# EAGLE design SterownikDriver_01 (EAGLE 7.5.0)
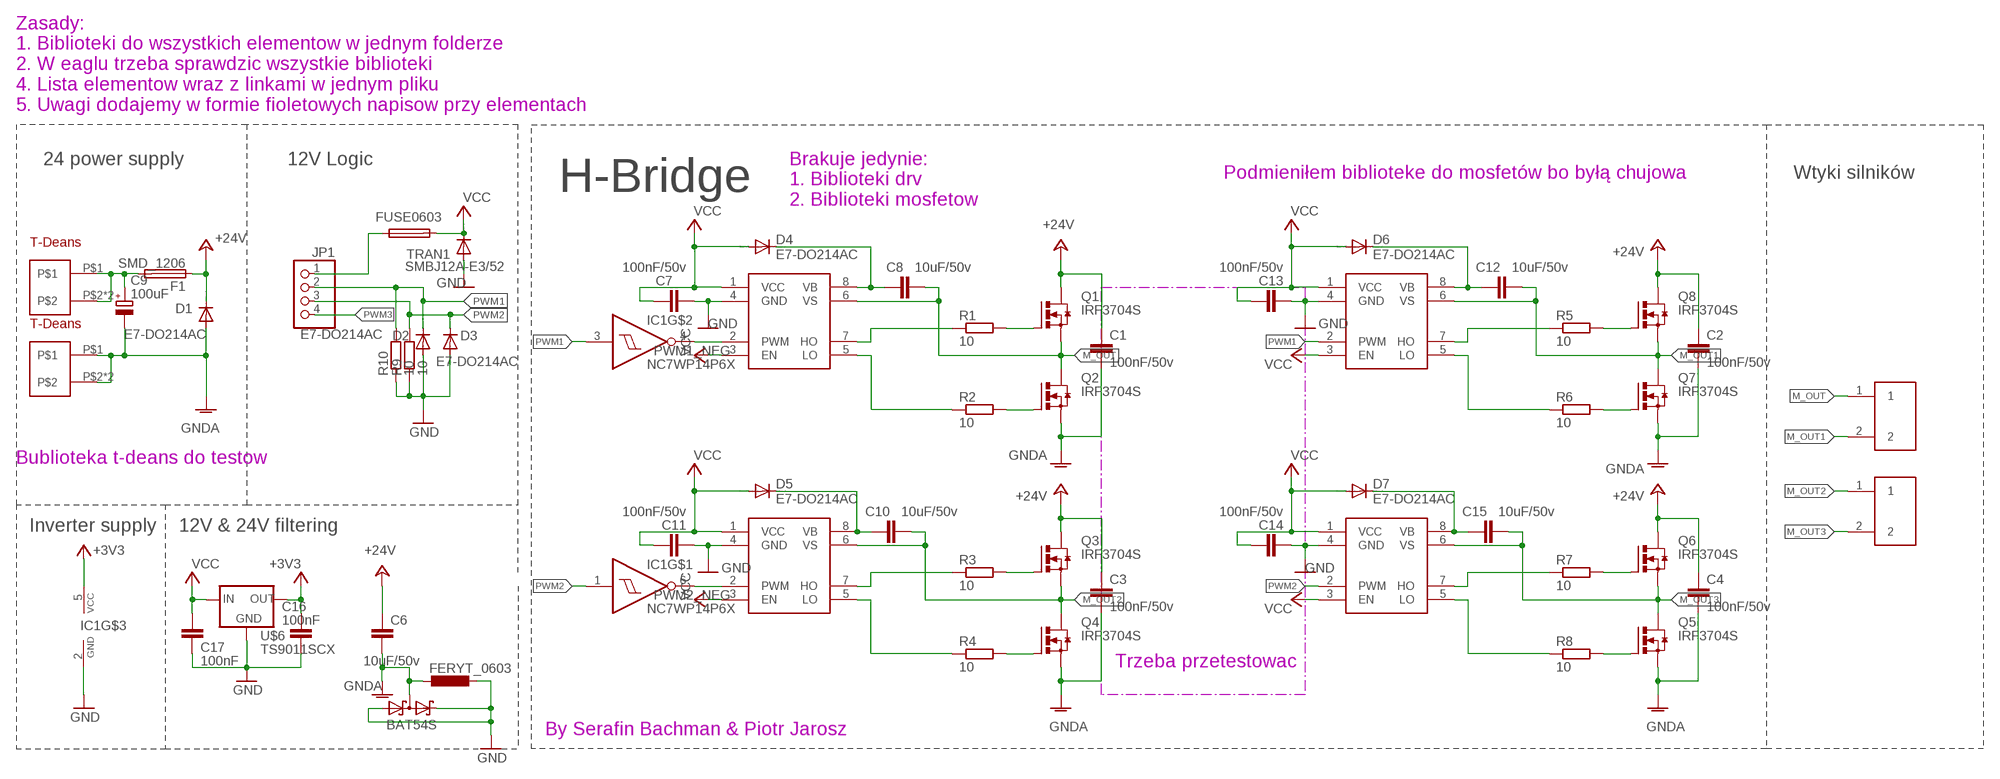
[diagram p0: schematic, sheet 1]

## Parts
C1  100nF/50v  C-EUC0603K  [C0603K]
C2  100nF/50v  C-EUC0603K  [C0603K]
C3  100nF/50v  C-EUC0603K  [C0603K]
C4  100nF/50v  C-EUC0603K  [C0603K]
C6  10uF/50v  C-EUC0603K  [C0603K]
C7  100nF/50v  C-EUC0603K  [C0603K]
C8  10uF/50v  C-EUC0603K  [C0603K]
C9  100uF  CPOL-EU140CLH-0810  [140CLH-0810]
C10  10uF/50v  C-EUC0603K  [C0603K]
C11  100nF/50v  C-EUC0603K  [C0603K]
C12  10uF/50v  C-EUC0603K  [C0603K]
C13  100nF/50v  C-EUC0603K  [C0603K]
C14  100nF/50v  C-EUC0603K  [C0603K]
C15  10uF/50v  C-EUC0603K  [C0603K]
C16  100nF  C-EUC0603K  [C0603K]
C17  100nF  C-EUC0603K  [C0603K]
D1  E7-DO214AC  [DO214AC]
D2  E7-DO214AC  [DO214AC]
D3  E7-DO214AC  [DO214AC]
D4  E7-DO214AC  [DO214AC]
D5  E7-DO214AC  [DO214AC]
D6  E7-DO214AC  [DO214AC]
D7  E7-DO214AC  [DO214AC]
D8  BAT54S  [SOT23]
F1  SMD_1206  [1026]
GND  T-DEANS  [T-DEANS]
IC1  NC7WP14P6X  [SOT65P210X110-6AN_SC88_SC70-6]
JP1  PINHD-1X4  [1X04]
Q1  IRF3704S  [D2PACK]
Q2  IRF3704S  [D2PACK]
Q3  IRF3704S  [D2PACK]
Q4  IRF3704S  [D2PACK]
Q5  IRF3704S  [D2PACK]
Q6  IRF3704S  [D2PACK]
Q7  IRF3704S  [D2PACK]
Q8  IRF3704S  [D2PACK]
R1  10  R-EU_R0603  [R0603]
R2  10  R-EU_R0603  [R0603]
R3  10  R-EU_R0603  [R0603]
R4  10  R-EU_R0603  [R0603]
R5  10  R-EU_R0603  [R0603]
R6  10  R-EU_R0603  [R0603]
R7  10  R-EU_R0603  [R0603]
R8  10  R-EU_R0603  [R0603]
R9  10  R-EU_R0603  [R0603]
R10  10  R-EU_R0603  [R0603]
TRAN1  SMBJ12A-E3/52  [DO214AA]
U1  IR2104  [SO08]
U2  IR2104  [SO08]
U3  IR2104  [SO08]
U4  IR2104  [SO08]
U$3  FUSE0603  [0603]
U$4  FERYT_0603  [R0603]
U$6  TS9011SCX  [SOT23]
U$7  PTB-02_5.08MM  [PTB-5.08MM-02]
U$9  PTB-02_5.08MM  [PTB-5.08MM-02]
VCC  T-DEANS  [T-DEANS]

## Nets
+3V3: C16.1 IC1.5(VCC) U$6.2(OUT)
+24V: C1.1 C2.1 C3.1 C4.1 C6.1 D1.C F1.P$1 Q1.2(D) Q3.2(D) Q6.2(D) Q8.2(D)
F2: JP1.1 U$3.1
GND: C7.2 C11.2 C13.2 C14.2 C16.2 C17.2 D2.A D3.A D8.1(A1) D8.2(C2) IC1.2(GND) R9.1 R10.1 TRAN1.A U1.4(GND) U2.4(GND) U3.4(GND) U4.4(GND) U$4.2 U$6.1(GND)
GNDA: C1.2 C2.2 C3.2 C4.2 C6.2 C9.- D1.A D8.3(C1A2) GND.P$1 GND.P$2 GND.P$3 Q2.3(S) Q4.3(S) Q5.3(S) Q7.3(S) U$4.1
M_OUT: C8.2 Q1.3(S) Q2.2(D) U1.6(VS) U$7.1
M_OUT1: C12.2 Q7.2(D) Q8.3(S) U2.6(VS) U$7.2
M_OUT2: C10.2 Q3.3(S) Q4.2(D) U3.6(VS) U$9.1
M_OUT3: C15.2 Q5.2(D) Q6.3(S) U4.6(VS) U$9.2
N$1: Q1.1(G) R1.2
N$2: Q2.1(G) R2.2
N$3: R1.1 U1.7(HO)
N$4: R2.1 U1.5(LO)
N$7: R5.1 U2.7(HO)
N$8: R6.1 U2.5(LO)
N$10: Q7.1(G) R6.2
N$11: Q8.1(G) R5.2
N$12: C10.1 D5.C U3.8(VB)
N$13: C9.+ F1.P$2 VCC.P$1 VCC.P$2 VCC.P$3
N$14: R3.1 U3.7(HO)
N$15: R4.1 U3.5(LO)
N$16: Q4.1(G) R4.2
N$17: Q3.1(G) R3.2
N$18: C15.1 D7.C U4.8(VB)
N$20: R7.1 U4.7(HO)
N$21: R8.1 U4.5(LO)
N$22: Q5.1(G) R8.2
N$23: Q6.1(G) R7.2
N$49: C8.1 D4.C U1.8(VB)
N$51: C12.1 D6.C U2.8(VB)
PWM1: D2.C IC1.3(I) JP1.2 R10.2 U2.2(PWM)
PWM1_NEG: IC1.4(O) U1.2(PWM)
PWM2: D3.C IC1.1(I) JP1.3 R9.2 U4.2(PWM)
PWM2_NEG: IC1.6(O) U3.2(PWM)
PWM3: JP1.4
VCC: C7.1 C11.1 C13.1 C14.1 C17.1 D4.A D5.A D6.A D7.A TRAN1.C U1.1(VCC) U1.3(EN) U2.1(VCC) U2.3(EN) U3.1(VCC) U3.3(EN) U4.1(VCC) U4.3(EN) U$3.2 U$6.3(IN)

## Notes on the sheet
- Zasady:
  1. Biblioteki do wszystkich elementow w jednym folderze
  2. W eaglu trzeba sprawdzic wszystkie biblioteki 
  4. Lista elementow wraz z linkami w jednym pliku
  5. Uwagi dodajemy w formie fioletowych napisow przy elementach
- 24 power supply | 12V Logic
- Podmieniłem biblioteke do mosfetów bo byłą chujowa | Wtyki silników
- H-Bridge
- Brakuje jedynie:
  1. Biblioteki drv
  2. Biblioteki mosfetow
- Bublioteka t-deans do testow
- Inverter supply | 12V & 24V filtering
- Trzeba przetestowac
- By Serafin Bachman & Piotr Jarosz

## Library data of the parts
C1-C4 C6-C8 C10-C17 = rcl:C-EU: CAPACITOR, European symbol
C9 = rcl:CPOL-EU: POLARIZED CAPACITOR, European symbol
D1-D7 = diode:E7-DO214AC
D8 = diode:BAT54S: Schottky Diodes Pin connection corrected 2011-05-04 Source: Fairchild .. BAT54.pdf
F1 = fuse:SMD_1206
GND VCC = Conector_T-deans:T-DEANS
IC1 = bufory,invertery:NC7W*14
JP1 = pinhead:PINHD-1X4: PIN HEADER
Q1-Q8 = transistor-power:IRF3704: SMPS MOSFET HEXFET® Power MOSFET Source: http://www.irf.com/product-info/datasheets/data/irf3704.pdf
R1-R10 = rcl:R-EU_: RESISTOR, European symbol
TRAN1 = diode:SMBJ12A-E3/52
U1-U4 = robione:IR2104
U$3 = fuse:FUSE0603
U$4 = rcl:FERYT_0603
U$6 = v-reg:TS9011SCX
U$7 U$9 = robione:PTB-02

## Board
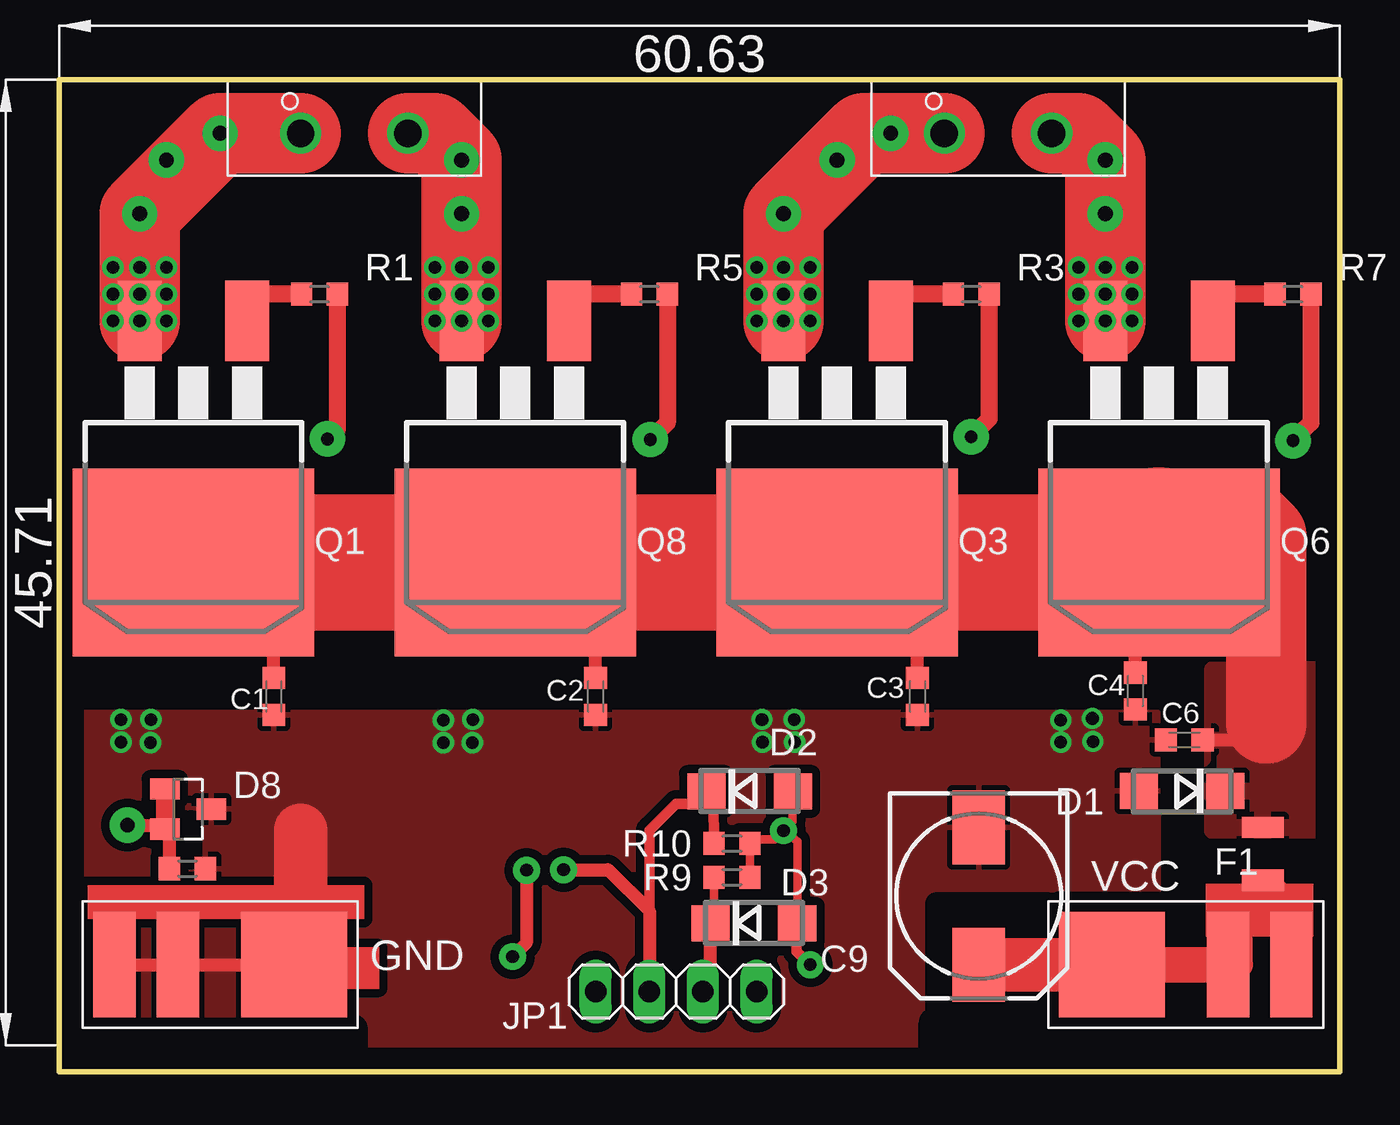
[diagram p1: board, top side]
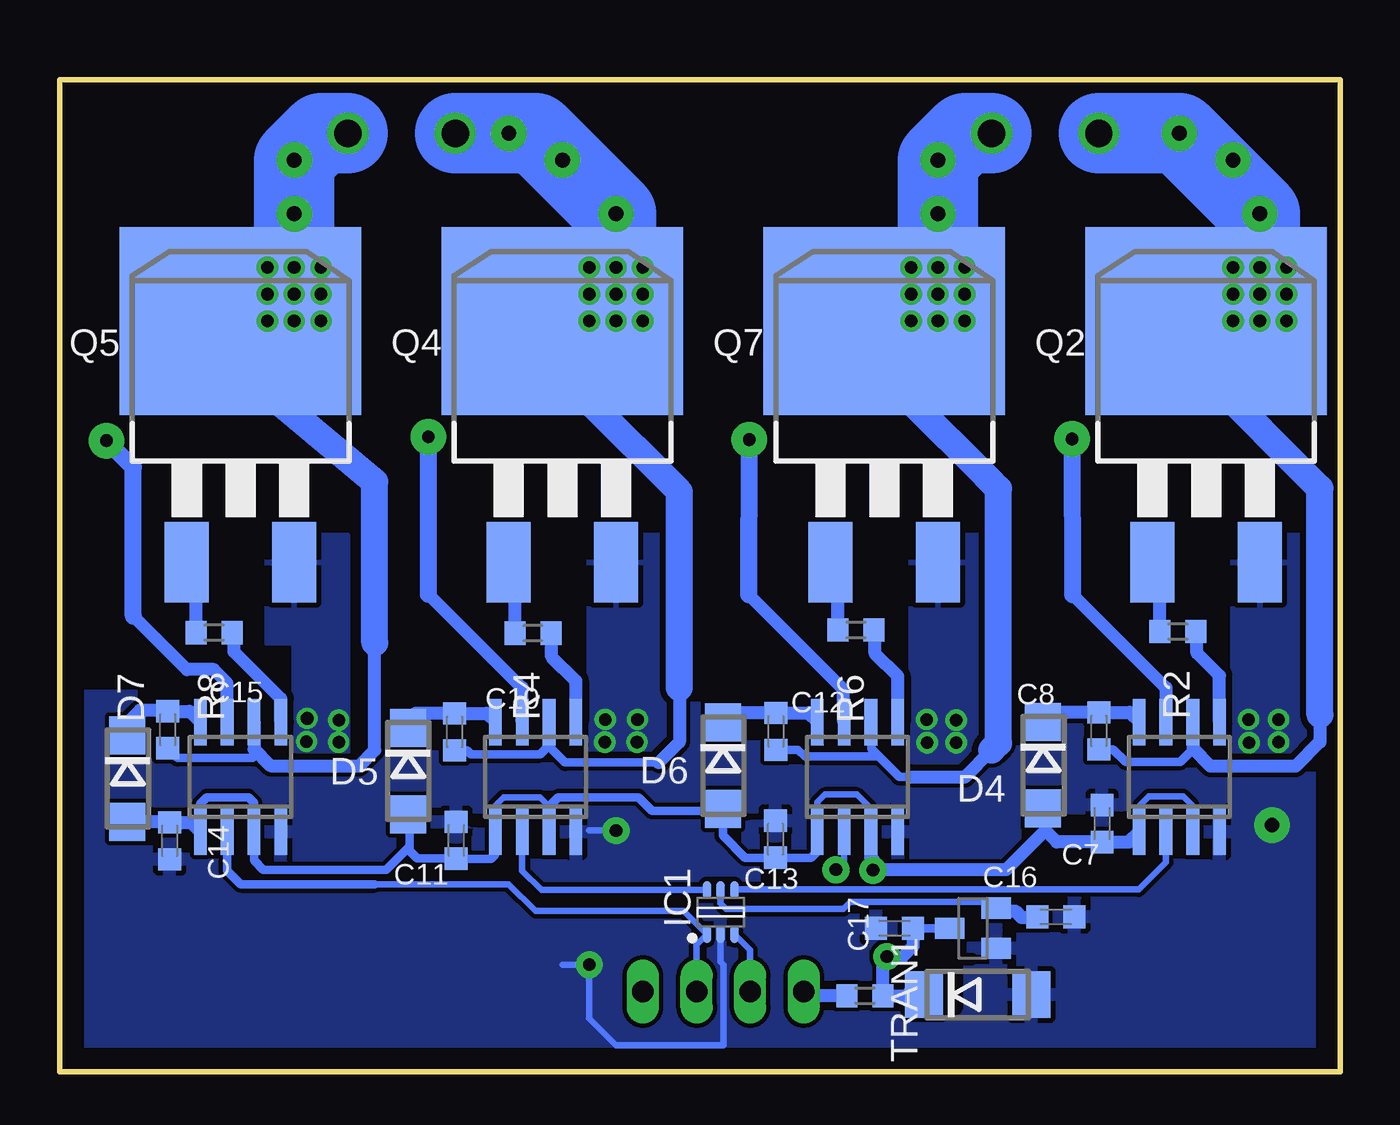
[diagram p2: board, bottom side, seen from below]

Size 60.63 x 46.98 mm. Coordinates in mm from the lower left corner, seen from the top.
Outline: 0,0 60.63,0 60.63,46.98 0,46.98 0,0
Copper layers (1*16): Top 0.035mm / dielectric 1.5mm / Bottom 0.035mm
Design rules "default": minimum track width 10mil, minimum drill 24mil, track to track 8mil, track to pad 8mil, pad to pad 8mil, via to via 8mil, smd to smd 8mil, copper to edge 40mil, drill to drill 8mil, minimum pad ring 10mil, minimum via ring 8mil, stop-mask expansion 4mil, vias tented up to drill 0mil, thermal gap 10mil
tRestrict: 14 lines
bRestrict: 9 lines

### Footprints (pad centres in the part's own frame; a part is rotated, then mirrored left to right if it is on the bottom)
C0603K = smd 1.05 x 1.08: 1 -0.875,0; 2 0.875,0
140CLH-0810 = smd 3.5 x 2.5: + 3.25,0; - -3.25,0
DO214AC = smd 1.8 x 1.7: A 2.05,0; C -2.05,0
SOT23 = smd 1 x 1.4: 1 -0.95,-1.1; 2 0.95,-1.1; 3 0,1.1
1026 = smd 1 x 2: P$1 -1.5,0.5; P$2 1,0.5
T-DEANS = smd 5 x 5: P$1 0,-3.5 | smd 5 x 2: P$2 0,2; P$3 0,5
SOT65P210X110-6AN_SC88_SC70-6 = smd 0.85 x 0.4: 1 -1.05,0.65; 2 -1.05,0; 3 -1.05,-0.65; 4 1.05,-0.65; 5 1.05,0; 6 1.05,0.65
1X04 = drill 1.016 long: 1 -3.81,0; 2 -1.27,0; 3 1.27,0; 4 3.81,0
D2PACK = smd 2.083 x 3.81: 1 -2.54,-8.89; 3 2.54,-8.89 | smd 11.43 x 8.89: 2 0,2.54
R0603 = smd 1 x 1.1: 1 -0.85,0; 2 0.85,0
DO214AA = smd 1.8 x 2.2: A 2.55,0; C -2.55,0
SO08 = smd 0.6 x 2.2: 1 -1.905,-2.6; 2 -0.635,-2.6; 3 0.635,-2.6; 4 1.905,-2.6; 5 1.905,2.6; 6 0.635,2.6; 7 -0.635,2.6; 8 -1.905,2.6
0603 = smd 1 x 1.1: 1 -0.85,0; 2 0.85,0
PTB-5.08MM-02 = drill 1.3: 1 -2.54,0; 2 2.54,0

### Placement (x,y rotation side)
C1  10.16,17.78 270 top
C2  25.4,17.78 270 top
C3  40.64,17.78 270 top
C4  50.95,18.03 270 top
C6  53.26,15.72 180 top
C7  11.28,11.76 90 bottom
C8  11.43,16.15 270 bottom
C9  43.54,8.33 270 top
C10  41.94,16.1 270 bottom
C11  41.86,10.97 90 bottom
C12  26.72,16.13 270 bottom
C13  26.75,11.02 90 bottom
C14  55.42,10.95 270 bottom
C15  55.52,16.21 270 bottom
C16  13.46,7.34 0 bottom
C17  21.11,6.81 180 bottom
D1  53.16,13.31 180 top
D2  32.69,13.28 0 top
D3  32.89,7.04 0 top
D4  14.07,14.53 270 bottom
D5  44.15,14.25 270 bottom
D6  29.24,14.5 270 bottom
D7  57.43,13.89 270 bottom
D8  6.1,12.45 270 top
F1  56.49,10.08 270 top
GND  7.62,5.08 90 top
IC1  29.34,7.57 90 bottom
JP1  29.21,3.81 0 top
Q1  6.35,26.67 180 top
Q2  6.35,33.02 0 bottom
Q3  36.83,26.67 180 top
Q4  36.83,33.02 0 bottom
Q5  52.07,33.02 0 bottom
Q6  52.07,26.67 180 top
Q7  21.59,33.02 0 bottom
Q8  21.59,26.67 180 top
R1  12.32,36.83 180 top
R2  7.7,20.85 180 bottom
R3  43.18,36.83 180 top
R4  38.23,20.78 180 bottom
R5  27.94,36.83 180 top
R6  22.94,20.93 180 bottom
R7  58.42,36.83 180 top
R8  53.31,20.8 180 bottom
R9  31.85,9.22 180 top
R10  31.85,10.82 180 top
TRAN1  17.17,3.66 0 bottom
U1  7.62,13.97 0 bottom
U2  22.86,13.97 0 bottom
U3  38.1,13.97 0 bottom
U4  52.07,13.97 0 bottom
U$3  22.5,3.61 0 bottom
U$4  6.07,9.63 180 top
U$6  17.4,6.81 90 bottom
U$7  13.97,44.45 0 top
U$9  44.45,44.45 0 top
VCC  53.34,5.08 270 top

### Tracks (layer width: path | path; a pad name or v marks a point on that pad's centre or on a via)
+3V3
  Bottom 0.305: IC1.5 29.34,7.98 29.08,7.72 23.52,7.72 23.19,8.05 16.59,8.05 U$6.2
  Bottom 0.406: U$6.2
  Bottom 0.61: U$6.2 16.16,7.62 15.39,7.62 15.09,7.31 14.36,7.31 C16.1
+24V
  Top 0.61: C4.1 50.95,21.44 49.53,22.86 | C1.1 10.16,22.86 8.89,24.13 | C2.1 25.4,20.32 Q8.2 | C3.1 40.64,20.32 Q3.2 | C6.1 56.36,15.72 57.15,16.51
  Top 0.813: 2.54,22.86 3.81,24.13 Q1.2 | 33.02,21.59 35.56,24.13 | 48.26,21.59 49.53,22.86 50.8,24.13
  Top 3.81: 57.15,16.51 57.15,25.4 55.88,26.67 53.34,26.67 52.07,25.4
  Top 6.452: Q1.2 8.89,24.13 Q8.2 35.56,24.13 Q3.2 50.8,24.13 Q6.2 52.07,25.4
  pour Top: 54.61,19.05 60.96,19.05 60.96,11.43 54.61,11.43
F2
  Bottom 0.61: U$3.1 25.2,3.61 JP1.1
GND  (via drill 0.6 pad 1.27, 0.7 pad 1.68)
  Top 0.406: 5.22,11.55 arc-90 5.18,11.68 | R9.1 R10.1 32.7,11.02 33.88,11.02 v34.29,11.43 | D2.A 34.71,11.85 v34.29,11.43 | D3.A 34.94,10.93 v34.29,11.43
  Top 0.5: D3.A 34.92,5.72 v35.56,5.08
  Top 0.61: U$4.2 5.22,11.55 D8.2 5,11.68 v3.23,11.68
  Top 0.813: D8.2 D8.1
  Bottom 0.305: 36.83,5.08 v35.56,5.08 35.56,2.54 34.29,1.27 29.21,1.27 29.21,5.08 29.34,5.21 IC1.2 | v34.29,11.43 35.56,11.43
  Bottom 0.406: 11.48,12.84 C7.2
  pour Bottom: 1.27,17.78 60.96,17.78 60.96,0 1.27,0
GNDA  (via drill 0.6 pad 0.61)
  Top 0.61: GND.P$3 10.16,5.08 11.43,6.35
  Top 2.54: 11.43,6.35 11.43,11.43
  other vias: 4.32,15.6 2.92,15.62 18.19,15.6 19.56,15.6 33.3,15.62 34.82,15.62 47.42,16.66 48.95,15.65 2.92,16.69 4.34,16.69 18.19,16.66 19.58,16.69 33.27,16.69 34.8,16.69 47.42,15.62 48.92,16.74
  pour Top (isolate 0.406): 1.22,17.02 52.02,17.02 52.07,1.27 1.27,1.27
  pour Bottom (isolate 0.305): 1.27,25.4 1.27,13.97 5.08,13.97 5.08,25.4
  pour Bottom (isolate 0.305): 16.51,25.4 16.51,13.97 20.32,13.97 20.32,25.4
  pour Bottom (isolate 0.305): 31.75,25.4 31.75,13.97 35.56,13.97 35.56,25.4
  pour Bottom (isolate 0.305): 46.99,13.97 49.53,13.97 49.53,20.32 50.8,20.32 50.8,25.4 46.99,25.4
M_OUT  (via drill 0.6, 0.7 pad 1.68)
  Top 3.81: Q1.3 v3.81,36.83 v3.81,38.1 v3.81,40.64 v7.62,44.45 U$7.1
  Bottom 0.406: C8.2 10.76,15.28 10.16,14.68 7.57,14.68 6.96,15.29
  Bottom 0.61: 0.96,16.92 0.96,15.62 2.11,14.48 6.15,14.48 6.96,15.29 6.96,16.55 U1.6
  Bottom 1.27: Q2.2 7.62,35.56 6.35,34.29 6.35,33.02 0.96,27.63 0.96,16.92
  Bottom 3.81: Q2.2 v5.08,36.83 v3.81,38.1 v3.81,40.64 v7.62,44.45 U$7.1
  other vias: 3.81,35.56
M_OUT1  (via drill 0.6, 0.7 pad 1.68)
  Top 3.81: Q8.3 v19.05,36.83 v19.05,38.1 v19.05,40.64 v19.05,43.18 17.78,44.45 U$7.2
  Bottom 0.406: 20.32,13.97 20.88,13.97 21.84,14.93 | 21.84,14.93 22.2,15.29 22.2,16.55 U2.6 | C12.2 25.67,15.25 25.35,14.93 21.84,14.93
  Bottom 0.61: 20.32,13.97 17.78,13.97 16.51,15.24
  Bottom 1.27: Q7.2 20.32,34.29 20.32,31.75 16.74,28.17 16.51,27.94 16.18,27.61 16.18,15.57 16.51,15.24
  Bottom 3.81: Q7.2 v20.32,36.83 v19.05,38.1 v19.05,40.64 v19.05,43.18 17.78,44.45 U$7.2
  other vias: 19.05,35.56
M_OUT2  (via drill 0.6, 0.7 pad 1.68)
  Top 3.81: Q3.3 v34.29,36.83 v34.29,38.1 v34.29,40.64 v36.83,43.18 38.1,44.45 v39.37,44.45 U$9.1
  Bottom 0.406: 32.26,14.66 36.7,14.66 37.49,15.44 | 37.49,15.44 37.49,16.55 U3.6 | C10.2 41.34,15.23 41.15,15.04 37.9,15.04 37.49,15.44
  Bottom 0.61: 31.29,18.19 31.29,15.62 32.26,14.66
  Bottom 1.27: Q4.2 35.56,34.29 35.56,31.75 31.29,27.48 31.29,18.19
  Bottom 3.81: Q4.2 v35.56,36.83 v34.29,38.1 v34.29,40.64 v36.83,43.18 38.1,44.45 v39.37,44.45 U$9.1
  other vias: 34.29,35.56
M_OUT3  (via drill 0.6, 0.7 pad 1.68)
  Top 3.81: Q6.3 v49.53,36.83 v49.53,38.1 v49.53,40.64 v49.53,43.18 48.26,44.45 U$9.2
  Bottom 0.406: 51.44,15.29 51.44,14.91 51.49,14.86 55.05,14.86 C15.2
  Bottom 0.61: 45.72,20.32 45.72,15.24 46.46,14.5 50.65,14.5 51.44,15.29 U4.6
  Bottom 1.27: 45.72,20.32 45.72,27.94 53.34,34.29 Q5.2
  Bottom 3.81: Q5.2 v50.8,36.83 v49.53,38.1 v49.53,40.64 v49.53,43.18 48.26,44.45 U$9.2
  other vias: 49.53,35.56
N$1
  Top 0.61: 9.31,35.98 Q1.1
  Top 0.813: R1.2 8.89,36.83 8.89,36.4 9.31,35.98
N$2
  Bottom 0.61: R2.2 8.55,23.79 Q2.1
N$3  (via drill 0.6 pad 1.68)
  Top 0.813: R1.1 13.17,30.44 v12.7,29.97
  Bottom 0.61: 8.28,16.59 U1.7 8.26,18.19 12.68,22.61
  Bottom 0.813: v12.7,29.97 12.68,22.61
N$4
  Bottom 0.61: U1.5 5.71,18.77 6.78,19.84 6.78,20.79 R2.1
N$5  (via drill 0.6)
  other vias: 2.54,38.1
N$6  (via drill 0.6)
  other vias: 2.54,36.83
N$7  (via drill 0.6 pad 1.68)
  Top 0.813: R5.1 28.79,30.75 v27.99,29.95
  Bottom 0.61: U2.7 23.52,16.59 23.52,18.11 28.02,22.61
  Bottom 0.813: v27.99,29.95 28.02,22.61
N$8
  Bottom 0.61: U2.5 20.95,18.75 22.02,19.81 22.02,20.86 R6.1
N$9  (via drill 0.7 pad 1.68)
  other vias: 5.08,43.18
N$10
  Bottom 0.61: R6.2 23.79,23.79 Q7.1
N$11
  Top 0.61: 24.55,35.98 Q8.1
  Top 0.813: R5.2 24.13,36.83 Q8.1
N$12
  Bottom 0.61: D5.C 43.77,16.98 C10.1 40.41,16.98 U3.8
N$13
  Top 0.254: 55.88,5.08 VCC.P$2 | 56.69,8.66 56.69,8.79 F1.P$2
  Top 0.305: 57.43,8.66 57.41,8.66 F1.P$2
  Top 1.27: 55.88,5.08 55.88,7.85 56.69,8.66 | VCC.P$3 58.34,7.75 57.43,8.66
  Top 1.676: VCC.P$1 VCC.P$2
  Top 2.54: 51.11,5.08 VCC.P$1 C9.+
N$14  (via drill 0.6 pad 1.68)
  Top 0.813: R3.1 44.03,30.92 v43.18,30.07
  Bottom 0.61: U3.7 38.73,18.19 43.18,22.63
  Bottom 0.813: v43.18,30.07 43.18,22.63
N$15
  Bottom 0.61: U3.5 36.2,18.52 37.34,19.66 37.34,20.74 R4.1
N$16
  Bottom 0.61: R4.2 39.08,23.84 Q4.1
N$17
  Top 0.61: 39.79,35.98 Q3.1
  Top 0.813: R3.2 39.37,36.83 Q3.1
N$18
  Bottom 0.305: 55.56,17.12 C15.1 | 57.45,16.66 57.45,16.51 57.45,15.97 D7.C
  Bottom 0.61: C15.1 54.48,17.08 U4.8 | 55.56,17.12 56.84,17.12 57.45,16.51
N$19  (via drill 0.6)
  other vias: 2.54,35.56
N$20  (via drill 0.6 pad 1.68)
  Top 0.813: R7.1 59.27,30.75 v58.42,29.9
  Bottom 0.61: 57.15,21.59 54.61,19.05 53.34,19.05 52.7,18.41 U4.7
  Bottom 0.813: 57.15,21.59 57.15,28.63 v58.42,29.9
N$21
  Bottom 0.61: U4.5 50.16,17.68 52.38,19.89 52.38,20.71 R8.1
N$22
  Bottom 0.61: R8.2 54.16,23.68 Q5.1
N$23
  Top 0.61: 54.61,36.83 Q6.1
  Top 0.813: R7.2 54.61,36.83
N$24  (via drill 0.6)
  other vias: 5.08,38.1
N$25  (via drill 0.6)
  other vias: 5.08,35.56
N$26  (via drill 0.6)
  other vias: 17.78,38.1
N$27  (via drill 0.6)
  other vias: 20.32,38.1
N$28  (via drill 0.6)
  other vias: 20.32,35.56
N$29  (via drill 0.6)
  other vias: 17.78,36.83
N$30  (via drill 0.6)
  other vias: 17.78,35.56
N$31  (via drill 0.6)
  other vias: 33.02,38.1
N$32  (via drill 0.6)
  other vias: 33.02,36.83
N$33  (via drill 0.6)
  other vias: 33.02,35.56
N$34  (via drill 0.6)
  other vias: 35.56,38.1
N$35  (via drill 0.6)
  other vias: 35.56,35.56
N$36  (via drill 0.6)
  other vias: 48.26,38.1
N$37  (via drill 0.6)
  other vias: 48.26,36.83
N$38  (via drill 0.6)
  other vias: 48.26,35.56
N$39  (via drill 0.6)
  other vias: 50.8,38.1
N$40  (via drill 0.6)
  other vias: 50.8,35.56
N$49
  Bottom 0.61: U1.8 9.98,17.03 C8.1 13.62,17.03 D4.C
N$51
  Bottom 0.61: D6.C 28.79,17 C12.1 25.2,17 U2.8
PWM1  (via drill 0.6 pad 1.27)
  Top 0.5: R10.2 30.98,12.82 D2.C 30.13,12.7 29.21,12.7 27.94,11.43 27.94,7.62
  Top 0.61: JP1.2 27.94,7.62 25.98,9.58 v23.88,9.58
  Bottom 0.305: JP1.2 27.94,5.77 IC1.3 | U2.2 23.5,9.96 v23.88,9.58
PWM1_NEG
  Bottom 0.305: U1.2 8.26,9.93 9.54,8.64 28.66,8.64 IC1.4
  Bottom 0.406: 8.23,11.34 U1.2
PWM2
  Top 0.406: R9.2 31,6.53 30.82,6.35
  Top 0.61: D3.C 30.82,6.35 30.82,4.15 JP1.3
  Bottom 0.305: 45.72,8.89 39.37,8.89 38.1,7.62 31.09,7.62 IC1.1 30.48,6.03 JP1.3
  Bottom 0.406: U4.2 52.7,9.53 52.07,8.89 45.72,8.89
PWM2_NEG
  Bottom 0.305: IC1.6 37.83,8.62 38.73,9.53 U3.2
VCC  (via drill 0.6 pad 1.27)
  Top 0.61: v22.12,9.55 22.12,6.12 v21.46,5.46
  Bottom 0.305: U2.3 22.23,12.47 22.89,13.13 24.41,13.13 24.77,12.78 U2.1 | 14.29,12.7 D4.A | U3.3 37.47,12.57 37.9,13 39.62,13 40.01,12.62 U3.1 | 29.21,12.43 D6.A 29.32,12.37 | 20.23,3.9 20.32,3.81 | U1.3 6.99,12.6 7.44,13.06 9.07,13.06 9.5,12.62 9.5,11.39 U1.1
  Bottom 0.406: 44.21,12.57 D5.A | U$6.3 C17.1 | 55.44,11.84 C14.1 | 44.07,10.69 45.19,9.58 51,9.58 51.44,10.01 U4.3 51.44,12.75 51.69,13 53.67,13 53.98,12.7 U4.1 | 44.07,12.43 D5.A | 44.07,10.69 44.07,12.12 D5.A | 29.32,12.37 32.59,12.37 33.22,13 37.03,13 37.47,12.57 | U2.1 24.74,11.34 24.74,10.46 25.06,10.15 C13.1 28.18,10.15 29.23,11.2 D6.A | 44.07,10.69 44.07,10.46 43.71,10.11 41.87,10.11 C11.1 40.22,10.1 40.03,10.29 40.03,11.34 U3.1
  Bottom 0.61: 43.64,12 D5.A | 13.57,11.97 D4.A 13.97,12.38 13.97,11.43 | U1.1 10.01,10.88 C7.1 13.43,10.88 13.97,11.43 | 29.16,12.38 D6.A | 13.97,11.43 15.82,9.58 22.1,9.58 v22.12,9.55 22.12,10.06 22.23,10.16 | 55.44,11.84 D7.A | C14.1 54.43,11.82 U4.1 | 22.23,9.75 22.23,10.16 | 22.23,10.16 U2.3 | TRAN1.C 20.17,3.66 20.32,3.81 20.52,3.61 U$3.2 21.65,5.27 v21.46,5.46 20.73,5.46 20.22,5.97 20.22,6.79 C17.1
(copper drawn outside any net)
  shapes: Top area x3

### Text on the board
tNames: VCC | GND